# EAGLE design decoder (EAGLE 7.2.0)
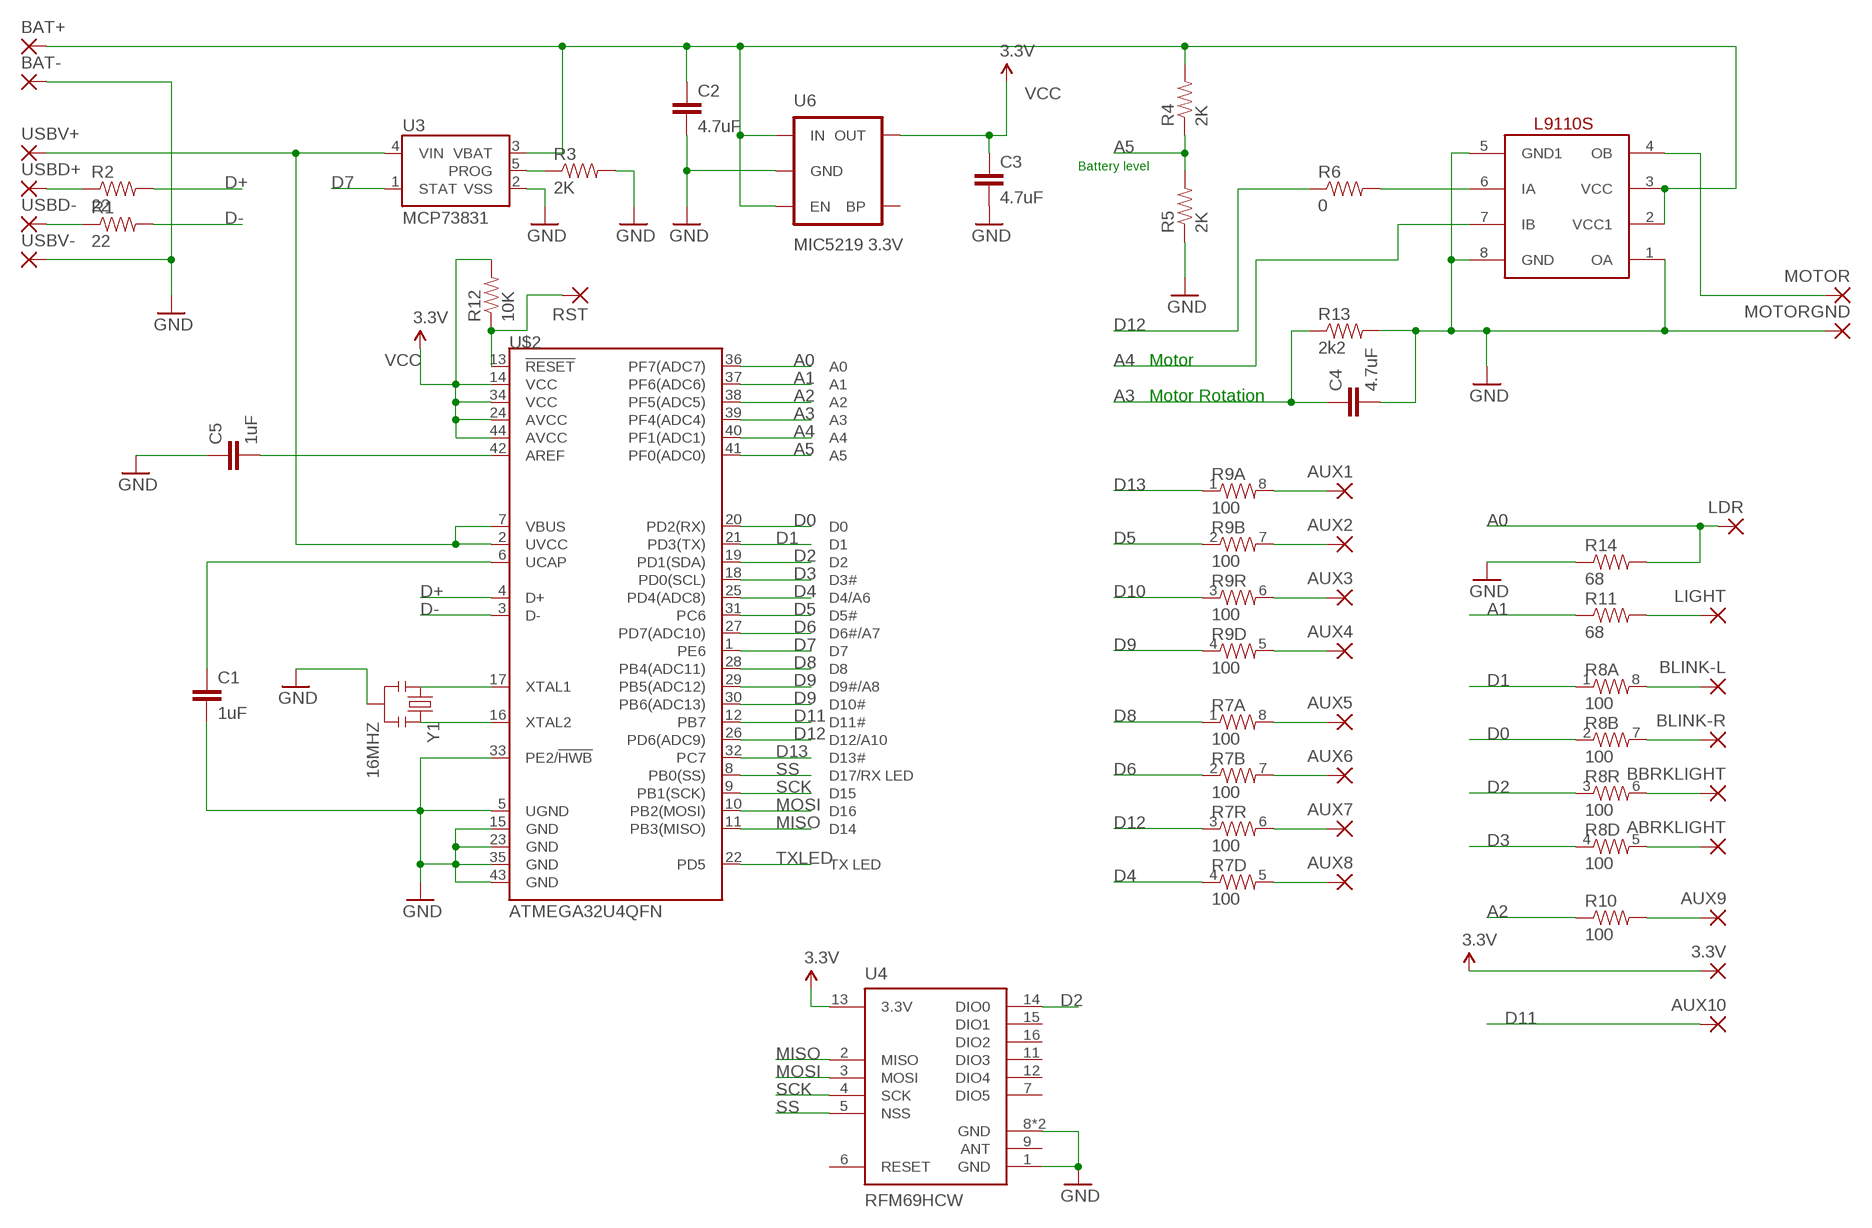
[diagram p0: schematic, sheet 1]

## Parts
3.3V  SMD2  [SMD1,27-2,54]
ABRKLIGHT  SMD2  [SMD1,27-2,54]
AUX1  SMD2  [SMD1,27-2,54]
AUX2  SMD2  [SMD1,27-2,54]
AUX3  SMD2  [SMD1,27-2,54]
AUX4  SMD2  [SMD1,27-2,54]
AUX5  SMD2  [SMD1,27-2,54]
AUX6  SMD2  [SMD1,27-2,54]
AUX7  SMD2  [SMD1,27-2,54]
AUX8  SMD2  [SMD1,27-2,54]
AUX9  SMD2  [SMD1,27-2,54]
AUX10  SMD2  [SMD1,27-2,54]
BAT+  SMD2  [SMD1,27-2,54]
BAT-  SMD2  [SMD1,27-2,54]
BBRKLIGHT  SMD2  [SMD1,27-2,54]
BLINK-L  SMD2  [SMD1,27-2,54]
BLINK-R  SMD2  [SMD1,27-2,54]
C1  1uF  CAP0805  [0805]
C2  4.7uF  CAP0805  [0805]
C3  4.7uF  CAP0805  [0805]
C4  4.7uF  CAP0805  [0805]
C5  1uF  CAP0805  [0805]
LDR  SMD2  [SMD1,27-2,54]
LIGHT  SMD2  [SMD1,27-2,54]
MOTOR  SMD2  [SMD1,27-2,54]
MOTORGND  SMD2  [SMD1,27-2,54]
R1  22  RESISTOR0603-RES  [0603-RES]
R2  22  RESISTOR0603-RES  [0603-RES]
R3  2K  RESISTOR0603-RES  [0603-RES]
R4  2K  RESISTOR0603-RES  [0603-RES]
R5  2K  RESISTOR0603-RES  [0603-RES]
R6  0  RESISTOR0603-RES  [0603-RES]
R7  100  RESISTOR-ARRAY0603-ARV  [0603-ARV]
R8  100  RESISTOR-ARRAY0603-ARV  [0603-ARV]
R9  100  RESISTOR-ARRAY0603-ARV  [0603-ARV]
R10  100  RESISTOR0603-RES  [0603-RES]
R11  68  RESISTOR0603-RES  [0603-RES]
R12  10K  RESISTOR0603-RES  [0603-RES]
R13  2k2  RESISTOR0603-RES  [0603-RES]
R14  68  RESISTOR0603-RES  [0603-RES]
RST  SMD2  [SMD1,27-2,54]
U3  MCP73831  [SOT23-5]
U4  RFM69HCW  [RFM69HCW-XXXS2]
U6  MIC5219 3.3V  V_REG_MIC52193.3V  [SOT23-5]
U$1  L9110S  [SO08]
U$2  ATMEGA32U4QFN  [SPARKFUN-DIGITALIC_QFN-44]
USBD+  SMD2  [SMD1,27-2,54]
USBD-  SMD2  [SMD1,27-2,54]
USBV+  SMD2  [SMD1,27-2,54]
USBV-  SMD2  [SMD1,27-2,54]
Y1  16MHZ  RESONATOR16MHZ  [RESONATOR-SMD]

## Nets
A0: LDR.1(P) R14.2 U$2.36(PF7(ADC7))
A1: R11.1 U$2.37(PF6(ADC6))
A2: R10.1 U$2.38(PF5(ADC5))
A3: C4.1 R13.1 U$2.39(PF4(ADC4))
A4: U$1.7(IB) U$2.40(PF1(ADC1))
A5: R4.1 R5.2 U$2.41(PF0(ADC0))
D0: R8.2 U$2.20(PD2(RX))
D1: R8.1 U$2.21(PD3(TX))
D2: R8.3 U4.14(DIO0) U$2.19(PD1(SDA))
D3: R8.4 U$2.18(PD0(SCL))
D4: R7.4 U$2.25(PD4(ADC8))
D5: R9.2 U$2.31(PC6)
D6: R7.2 U$2.27(PD7(ADC10))
D7: U3.1(STAT) U$2.1(PE6)
D8: R7.1 U$2.28(PB4(ADC11))
D9: R9.4 U$2.29(PB5(ADC12))
D10: R9.3 U$2.30(PB6(ADC13))
D11: AUX10.1(P) U$2.12(PB7)
D12: R6.1 R7.3 U$2.26(PD6(ADC9))
D13: R9.1 U$2.32(PC7)
D+: R2.2 U$2.4(D+)
D-: R1.2 U$2.3(D-)
GND: BAT-.1(P) C1.2 C2.2 C3.2 C4.2 C5.1 MOTORGND.1(P) R3.2 R5.1 R13.2 R14.1 U3.2(VSS) U4.1(GND) U4.8(GND) U4.10(GND) U6.2(GND) U$1.1(OA) U$1.5(GND1) U$1.8(GND) U$2.5(UGND) U$2.15(GND) U$2.23(GND) U$2.33(PE2/!HWB) U$2.35(GND) U$2.43(GND) USBV-.1(P) Y1.2
MISO: U4.2(MISO) U$2.11(PB3(MISO))
MOSI: U4.3(MOSI) U$2.10(PB2(MOSI))
N$1: C1.1 U$2.6(UCAP)
N$2: C5.2 U$2.42(AREF)
N$3: U$2.17(XTAL1) Y1.1
N$4: U$2.16(XTAL2) Y1.3
N$5: R12.1 RST.1(P) U$2.13(!RESET)
N$7: R2.1 USBD+.1(P)
N$8: R1.1 USBD-.1(P)
N$9: U3.4(VIN) U$2.2(UVCC) U$2.7(VBUS) USBV+.1(P)
N$10: BAT+.1(P) C2.1 R4.2 U3.3(VBAT) U6.1(IN) U6.3(EN) U$1.2(VCC1) U$1.3(VCC)
N$11: R3.1 U3.5(PROG)
N$12: LIGHT.1(P) R11.2
N$13: BLINK-L.1(P) R8.8
N$14: R6.2 U$1.6(IA)
N$16: BLINK-R.1(P) R8.7
N$18: BBRKLIGHT.1(P) R8.6
N$20: ABRKLIGHT.1(P) R8.5
N$21: AUX1.1(P) R9.8
N$22: AUX2.1(P) R9.7
N$23: AUX3.1(P) R9.6
N$24: AUX4.1(P) R9.5
N$25: AUX5.1(P) R7.8
N$26: AUX6.1(P) R7.7
N$27: AUX7.1(P) R7.6
N$28: AUX8.1(P) R7.5
N$29: AUX9.1(P) R10.2
OB: MOTOR.1(P) U$1.4(OB)
SCK: U4.4(SCK) U$2.9(PB1(SCK))
SS: U4.5(NSS) U$2.8(PB0(SS))
TXLED: U$2.22(PD5)
VCC: 3.3V.1(P) C3.1 R12.2 U4.13(3.3V) U6.5(OUT) U$2.14(VCC) U$2.24(AVCC) U$2.34(VCC) U$2.44(AVCC) ; supply symbol labelled 3.3V
Unconnected: U4.6(RESET) U4.7(DIO5) U4.9(ANT) U4.11(DIO3) U4.12(DIO4) U4.15(DIO1) U4.16(DIO2) U6.4(BP)

## Notes on the sheet
- Battery level
- Motor
- Motor Rotation

## Library data of the parts
3.3V ABRKLIGHT AUX1-AUX10 BAT+ BAT- BBRKLIGHT BLINK-L BLINK-R LDR LIGHT MOTOR MOTORGND RST USBD+ USBD- USBV+ USBV- = wirepad:SMD2: SMD PAD
C1-C5 = SparkFun-Capacitors:CAP: Capacitor Standard 0603 ceramic capacitor, and 0.1" leaded capacitor.
R1-R6 R10-R14 = SparkFun-Resistors:RESISTOR: Resistor Basic schematic elements and footprints for 0603, 1206, and PTH resistors.
R7-R9 = SparkFun-Resistors:RESISTOR-ARRAY: Array Chip Resistor Source: RS Component / Phycomp
U3 = SparkFun-PowerIC:MCP73831: Miniature single cell, fully integrated Li-Ion, Li-polymer charge management controller http://ww1.microchip.com/downloads/en/DeviceDoc/21984a.pdf IC-09995; PROD_ID: IC-09995
U4 = SparkFun-RF:RFM69H
U6 = SparkFun-PowerIC:V_REG_MIC5219: V_REG MIC5219 Standard 3.3V and 5V 500mA LDO voltage regulator in SOT-23 layout. Micrel part MIC5219. BP (by-pass) pin is used to lower output noise with 470pF cap, may be left open.; PROD_ID: VREG-09872
U$1 = h-bridge-l9119s:L9110S: H Bridge L9110s
U$2 = SparkFun-Retired:ATMEGA32U4: Atmel 44-pin 8-bit Microcontroller with 32KBytes of ISP Flash and USB Controller ----- Please use the QFN-44-NOPAD_1:1 package for the footprint of all boards using a 32U4. Route traces directly away from the pads as much as possible.
Y1 = SparkFun-FreqCtrl:RESONATOR: Resonator Small SMD resonator. Used, eg, on the Arduino Pro/ Pro Mini boards. 8MHz- XTAL-08895 16MHz- XTAL-08900; PROD_ID: XTAL-08900

## Board
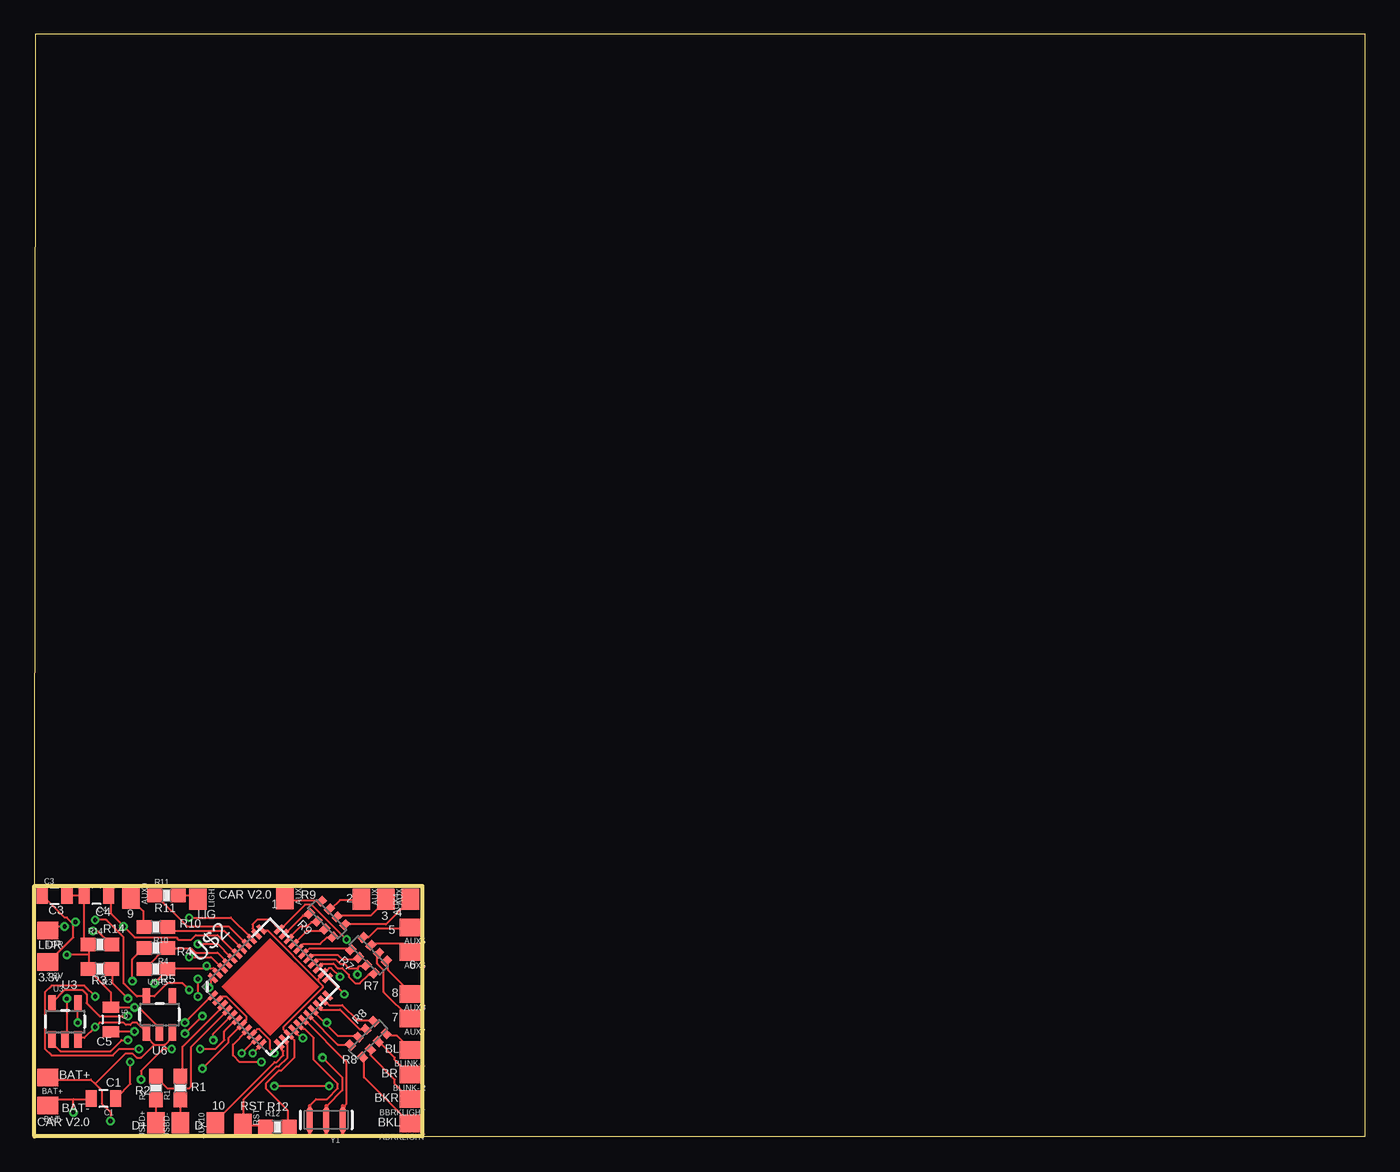
[diagram p1: board, top side]
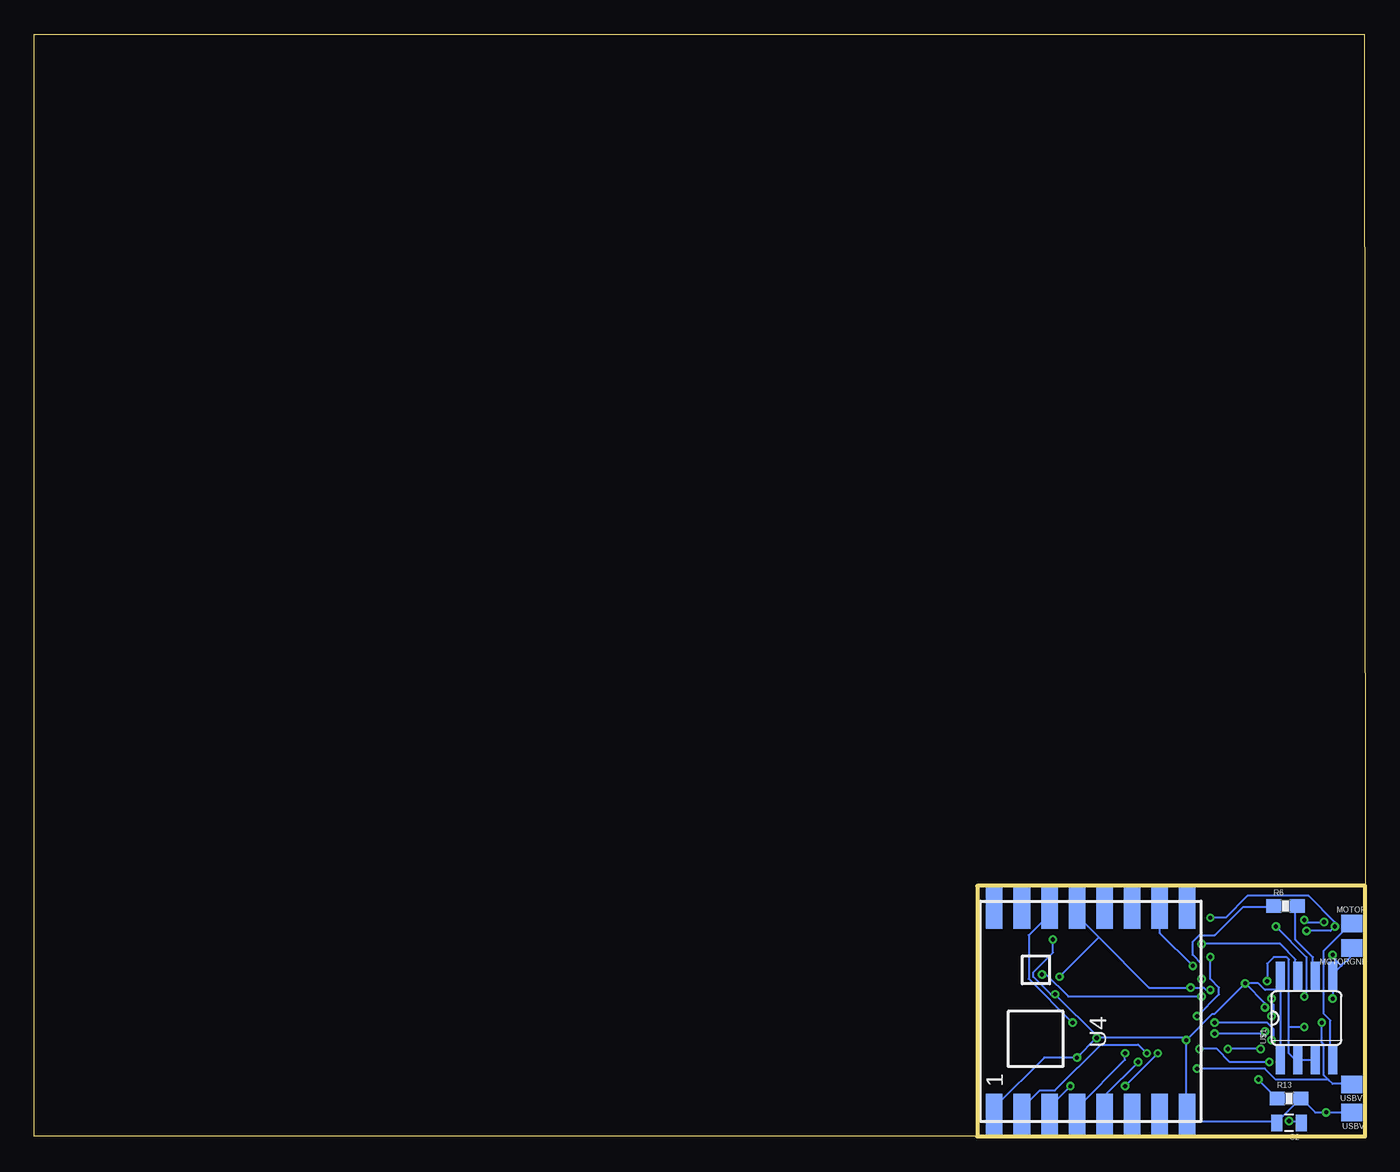
[diagram p2: board, bottom side, seen from below]

Size 96.64 x 80 mm. Coordinates in mm from the lower left corner, seen from the top.
Outline: 28.16,0 96.64,0 96.64,80 0.07,80 0,18.18
Outline: 0,18.18 28.16,18.18 28.16,0
Outline: 28.16,0 0,0 0,18.18
Copper layers (1*16): Top 0.035mm / dielectric 1.5mm / Bottom 0.035mm
Design rules "Elecrow_2-layer_eagle_rule": minimum track width 6mil, minimum drill 12mil, track to track 6mil, track to pad 6mil, pad to pad 6mil, via to via 6mil, smd to smd 0mil, copper to edge 10mil, drill to drill 10mil, minimum pad ring 10mil, minimum via ring 6mil, stop-mask expansion 2mil, vias tented up to drill 100mil, thermal gap 10mil

### Footprints (pad centres in the part's own frame; a part is rotated, then mirrored left to right if it is on the bottom)
SMD1,27-2,54 = smd 1.27 x 1.524: 1 0,0
0805 = smd 0.8 x 1.2: 1 -0.9,0; 2 0.9,0
0603-RES = smd 1.1 x 1: 1 -0.85,0; 2 0.85,0
0603-ARV = smd 0.5 x 0.65: 1 -1.2,-0.625; 2 -0.4,-0.625; 3 0.4,-0.625; 4 1.2,-0.625; 5 1.2,0.625; 6 0.4,0.625; 7 -0.4,0.625; 8 -1.2,0.625
SOT23-5 = smd 0.55 x 1.2: 1 -0.95,-1.3; 2 0,-1.3; 3 0.95,-1.3; 4 0.95,1.3; 5 -0.95,1.3
RFM69HCW-XXXS2 = smd 3 x 1.2: 1 -7.5,7; 2 -7.5,5; 3 -7.5,3; 4 -7.5,1; 5 -7.5,-1; 6 -7.5,-3; 7 -7.5,-5; 8 -7.5,-7; 9 7.5,-7; 10 7.5,-5; 11 7.5,-3; 12 7.5,-1; 13 7.5,1; 14 7.5,3; 15 7.5,5; 16 7.5,7
SO08 = smd 0.66 x 2.032: 1 -1.905,-3.073; 2 -0.635,-3.073; 3 0.635,-3.073; 4 1.905,-3.073; 5 1.905,3.073; 6 0.635,3.073; 7 -0.635,3.073; 8 -1.905,3.073
SPARKFUN-DIGITALIC_QFN-44 = smd 0.8 x 0.3: 1 -3.4,2.5; 2 -3.4,2; 3 -3.4,1.5; 4 -3.4,1; 5 -3.4,0.5; 6 -3.4,0; 7 -3.4,-0.5; 8 -3.4,-1; 9 -3.4,-1.5; 10 -3.4,-2; 11 -3.4,-2.5; 23 3.4,-2.5; 24 3.4,-2; 25 3.4,-1.5; 26 3.4,-1; 27 3.4,-0.5; 28 3.4,0; 29 3.4,0.5; 30 3.4,1; 31 3.4,1.5; 32 3.4,2; 33 3.4,2.5 | smd 0.3 x 0.8: 12 -2.5,-3.4; 13 -2,-3.4; 14 -1.5,-3.4; 15 -1,-3.4; 16 -0.5,-3.4; 17 0,-3.4; 18 0.5,-3.4; 19 1,-3.4; 20 1.5,-3.4; 21 2,-3.4; 22 2.5,-3.4; 34 2.5,3.4; 35 2,3.4; 36 1.5,3.4; 37 1,3.4; 38 0.5,3.4; 39 0,3.4; 40 -0.5,3.4; 41 -1,3.4; 42 -1.5,3.4; 43 -2,3.4; 44 -2.5,3.4
RESONATOR-SMD = smd 0.45 x 1.905: 1 -1.2,0; 2 0,0; 3 1.2,0

### Placement (x,y rotation side)
3.3V  0.96,12.66 90 top
ABRKLIGHT  27.29,0.95 90 top
AUX1  18.19,17.24 180 top
AUX2  23.73,17.21 180 top
AUX3  25.51,17.21 180 top
AUX4  27.29,17.21 0 top
AUX5  27.29,15.18 90 top
AUX6  27.29,13.4 90 top
AUX7  27.29,8.57 90 top
AUX8  27.29,10.35 90 top
AUX9  7.02,17.27 180 top
AUX10  13.15,0.97 0 top
BAT+  0.96,4.28 90 top
BAT-  0.96,2.24 90 top
BBRKLIGHT  27.29,2.73 90 top
BLINK-L  27.29,6.29 90 top
BLINK-R  27.29,4.51 90 top
C1  5.02,2.75 180 top
C2  5.53,0.97 180 bottom
C3  1.46,17.48 0 top
C4  4.51,17.48 180 top
C5  5.55,8.49 270 top
LDR  0.96,14.94 90 top
LIGHT  11.88,17.23 180 top
MOTOR  0.96,15.45 270 bottom
MOTORGND  0.96,13.67 90 bottom
R1  10.61,3.51 90 top
R2  8.83,3.51 90 top
R3  4.77,12.15 180 top
R4  8.83,13.67 180 top
R5  8.83,12.15 180 top
R6  5.78,16.72 0 bottom
R7  24.27,13.14 315 top
R8  24.24,7.05 225 top
R9  21.26,15.78 315 top
R10  8.83,15.2 180 top
R11  9.59,17.48 0 top
R12  17.64,0.7 0 top
R13  5.53,2.75 0 bottom
R14  4.77,13.93 0 top
RST  15.12,0.9 180 top
U3  2.23,8.34 0 top
U4  19.92,9.08 90 bottom
U6  9.08,8.85 0 top
U$1  4.26,8.59 0 bottom
U$2  17.13,10.86 45 top
USBD+  8.83,0.97 0 top
USBD-  10.61,0.97 0 top
USBV+  0.96,3.77 90 bottom
USBV-  0.96,1.74 90 bottom
Y1  21.19,1.21 180 top

### Tracks (layer width: path | path; a pad name or v marks a point on that pad's centre or on a via)
A0  (via drill 0.3)
  Top 0.152: v11.24,15.88 14.26,15.88 15.69,14.45 U$2.36 | v2.19,15.24 1.24,15.24 1.08,15.08 LDR.1 | v4.26,14.92 4.58,14.92 5.53,13.97 R14.2
  Bottom 0.152: v11.24,15.88 10.13,15.88 8.54,17.46 4.1,17.46 2.19,15.56 v2.19,15.24 2.51,14.92 v4.26,14.92
A1
  Top 0.152: U$2.37 15.37,13.97 14.1,15.24 11.08,15.24 8.86,17.46 R11.1
A2
  Top 0.152: U$2.38 15.05,13.65 13.78,14.92 9.97,14.92 9.81,15.08 R10.1
A3  (via drill 0.3)
  Top 0.152: U$2.39 14.58,13.34 13.31,14.61 11.72,14.61 11.4,14.29 10.45,14.29 10.29,14.45 7.27,14.45 v6.48,15.24 5.53,16.19 5.53,17.46 C4.1 | v7.75,4.13 7.75,4.76 9.34,6.35 v9.97,6.35 | v7.59,6.35 6.16,6.35 5.69,5.87 1.24,5.87 0.77,6.35 0.77,10.48 1.24,10.95 3.62,10.95 v4.42,10.16
  Bottom 0.152: v7.75,4.13 6.48,2.86 R13.1 | v7.59,6.35 v9.97,6.35 | v4.42,10.16 4.42,10.32 4.26,10.48 4.26,13.02 v6.48,15.24
A4  (via drill 0.3)
  Top 0.152: v11.88,13.97 13.31,13.97 14.26,13.02 U$2.40
  Bottom 0.152: v11.88,13.97 6.16,13.97 5.05,12.86 5.05,11.75 U$1.7
A5
  Top 0.152: U$2.41 13.94,12.7 13.31,13.34 11.72,13.34 11.4,13.65 9.81,13.65 R4.1 9.66,13.81 8.07,12.22 R5.2
D0
  Top 0.152: R8.2 23.94,7.78 23.63,7.78 22.2,9.21 20.77,9.21 20.61,9.37 U$2.20
D1
  Top 0.152: R8.1 24.58,8.41 23.47,8.41 22.36,9.53 21.4,9.53 21.09,9.84 U$2.21
D2  (via drill 0.3)
  Top 0.152: 21.09,8.26 20.29,9.05 U$2.19 | 21.09,8.26 22.04,7.3 23.47,7.3 R8.3 | v21.24,8.26 21.09,8.26
  Bottom 0.152: v21.24,8.26 24.42,11.43 24.42,14.61 22.99,16.03 22.99,16.51 U4.14
D3
  Top 0.152: R8.4 22.83,6.67 22.04,6.67 19.97,8.73 U$2.18
D4
  Top 0.152: R7.4 24.58,11.75 24.26,11.75 23.63,11.11 23.31,11.11 22.83,11.59 22.83,11.75 22.36,12.22 22.04,12.22 21.72,12.54 20.93,12.54 20.61,12.22 U$2.25
D5
  Top 0.152: R9.2 20.45,15.56 20.13,15.56 19.81,15.24 19.34,15.24 18.54,14.45 U$2.31
D6
  Top 0.152: R7.2 23.47,12.86 22.36,12.86 22.04,13.18 20.13,13.18 19.97,13.02 U$2.27
D7  (via drill 0.3)
  Top 0.152: v10.92,8.26 12.83,10.16 U$2.1 | v6.8,6.99 6.32,6.99 5.53,6.19 1.88,6.19 1.4,6.67 1.4,6.99 U3.1
  Bottom 0.152: v10.92,8.26 7.11,8.26 6.64,7.78 6.64,7.14 v6.8,6.99
D8
  Top 0.152: R7.1 22.83,13.65 19.97,13.65 19.66,13.34 U$2.28
D9
  Top 0.152: R9.4 21.56,14.45 21.24,14.45 20.77,13.97 19.5,13.97 19.18,13.65 U$2.29
D10
  Top 0.152: R9.3 21.09,14.92 19.81,14.92 18.86,13.97 U$2.30
D11
  Top 0.152: U$2.12 17.91,6.67 17.91,6.35 18.07,6.19 18.07,5.87 17.59,5.4 17.43,5.4 13.15,1.11 AUX10.1
D12  (via drill 0.3)
  Top 0.152: 23.47,12.22 23.63,12.38 24.1,12.38 R7.3 | 23.47,12.22 22.83,12.22 22.51,12.54 22.2,12.54 21.88,12.86 20.45,12.86 20.29,12.7 U$2.26 | v11.88,10.16 v11.88,11.43 | 23.47,12.22 v23.47,11.75
  Bottom 0.152: v11.88,11.43 11.88,12.54 12.51,13.18 12.51,14.13 12.04,14.61 10.92,14.61 8.86,16.67 6.64,16.67 R6.1 | v11.88,10.16 21.56,10.16 23.15,11.75 v23.47,11.75
D13
  Top 0.152: R9.1 19.81,16.03 19.5,16.03 18.23,14.76 U$2.32
D+
  Top 0.152: U$2.4 13.94,9.05 11.4,6.51 11.4,3.65 11.24,3.49 9.66,3.49 8.86,4.29 R2.2
D-
  Top 0.152: U$2.3 13.62,9.37 10.77,6.51 10.77,4.45 R1.2
GND  (via drill 0.3)
  Top 0.152: v2.35,10 2.35,7.14 U3.2 | C3.2 2.51,17.46 3.46,17.46 C4.2 3.62,17.46 3.62,14.13 3.78,13.97 R14.1 3.94,13.81 3.94,13.18 | 3.94,13.18 3.94,12.22 R3.2 3.94,12.06 5.53,10.48 5.53,9.53 C5.1 5.69,9.37 v7.27,9.37 7.59,9.37 9.02,7.94 9.02,7.62 U6.2 | 3.94,13.18 v2.35,13.18 | 12.51,12.22 9.81,12.22 R5.1 9.66,12.06 v8.7,11.11 | 12.51,12.22 12.99,12.22 13.31,11.91 U$2.43 | 12.51,12.22 v12.51,12.38 | 2.83,2.7 1.4,2.7 1.08,2.38 BAT-.1 | 2.83,2.7 4.1,2.7 C1.2 | v2.83,1.75 2.83,2.7 | U$2.35 16,14.76 16,14.92 15.85,15.08 15.85,15.4 16.16,15.72 17.12,15.72 17.75,15.08 U$2.33 17.91,15.08 19.66,16.83 20.13,16.83 v22.67,14.29 | v12.99,6.99 12.99,7.46 14.26,8.73 U$2.5 | v19.5,7.14 19.34,7.14 18.86,7.62 U$2.15 | v22.51,10.32 21.4,11.43 U$2.23 | v20.93,5.71 22.36,4.29 22.36,3.33 21.24,2.22 Y1.2
  Bottom 0.152: v2.35,10 2.35,11.59 U$1.5 2.35,11.75 1.72,12.38 | 1.72,12.38 1.08,13.02 1.08,13.65 MOTORGND.1 | 1.72,12.38 2.35,13.02 v2.35,13.18 | 6.16,10.64 6.16,11.59 U$1.8 | 6.16,10.64 6.16,5.56 U$1.1 | v8.7,11.11 7.75,11.11 7.27,10.64 6.16,10.64 | v12.51,12.38 14.89,14.76 14.89,16.51 U4.10 | v7.27,9.37 7.27,9.68 v8.7,11.11 | USBV-.1 1.08,1.75 v2.83,1.75 3.62,1.75 4.58,2.7 R13.2 4.73,2.7 6.32,1.11 C2.2 6.48,1.11 12.51,1.11 12.83,1.43 U4.8 12.99,1.59 v12.99,6.99 | 19.34,7.14 13.15,7.14 v12.99,6.99 | 19.34,7.14 v22.51,10.32 22.83,10.32 24.1,11.59 24.1,11.91 22.67,13.34 v22.67,14.29 | 19.34,7.14 v19.5,7.14 v20.93,5.71 23.31,5.71 26.8,2.22 26.8,1.59 U4.1 | v8.7,11.11 10.92,8.89 11.08,8.89 v12.99,6.99
MISO  (via drill 0.3)
  Top 0.152: v15.85,6.03 16.48,6.67 U$2.11
  Bottom 0.152: v15.85,6.03 16.48,6.67 19.18,6.67 22.51,3.33 23.63,3.33 24.9,2.06 24.9,1.59 U4.2
MOSI  (via drill 0.3)
  Top 0.152: v15.05,6.03 16,6.99 U$2.10 | v21.4,3.65 v17.43,3.65
  Bottom 0.152: v17.43,3.65 v15.05,6.03 | v21.4,3.65 22.83,2.22 22.83,1.59 U4.3
N$1  (via drill 0.3)
  Top 0.152: v12.04,6.35 13.15,6.35 13.78,6.99 13.78,7.62 14.58,8.41 U$2.6 | v6.96,5.4 6.96,3.81 6,2.86 C1.1
  Bottom 0.152: v12.04,6.35 10.77,6.35 9.81,5.4 v6.96,5.4
N$2  (via drill 0.3)
  Top 0.152: v11.24,13.02 12.83,13.02 13.62,12.22 U$2.42 | v10.92,7.46 v12.19,8.73 | v7.27,7.62 5.69,7.62 C5.2
  Bottom 0.152: v11.24,13.02 11.24,11.43 10.61,10.79 10.61,10.32 v12.19,8.73 | v10.92,7.46 7.43,7.46 v7.27,7.62
N$3
  Top 0.152: U$2.17 19.66,8.41 22.67,5.4 22.67,2.38 22.51,2.22 Y1.1
N$4
  Top 0.152: U$2.16 19.5,7.78 19.66,7.78 20.29,7.14 20.29,5.56 22.04,3.81 22.04,3.49 21.24,2.7 20.45,2.7 19.97,2.22 Y1.3
N$5
  Top 0.152: U$2.13 18.23,6.99 18.39,6.83 18.39,5.71 17.75,5.08 17.59,5.08 15.21,2.7 15.21,0.95 RST.1 15.21,0.79 16.64,0.79 R12.1
N$7
  Top 0.152: R2.1 8.86,2.54 8.86,1.11 USBD+.1
N$8
  Top 0.152: R1.1 10.61,2.54 10.61,1.11 USBD-.1
N$9  (via drill 0.3)
  Top 0.152: U$2.2 13.47,10 13.62,10.16 13.94,10.16 15.37,8.73 15.37,8.41 15.21,8.26 U$2.7 15.05,8.1 14.1,7.14 14.1,6.83 v12.19,4.92 | v3.15,8.26 3.15,9.53 U3.4
  Bottom 0.152: v3.15,8.26 3.15,6.83 2.99,6.67 2.99,4.45 2.67,4.13 | 2.67,4.13 2.35,3.81 1.08,3.81 USBV+.1 | v12.19,4.92 7.27,4.92 6.48,4.13 2.67,4.13
N$10  (via drill 0.3)
  Top 0.152: v7.11,11.27 7.11,12.86 7.91,13.65 R4.2 | U3.3 3.31,7.14 3.62,7.14 v4.42,7.94 4.73,8.26 6.48,8.26 6.64,8.1 6.96,8.1 7.11,8.26 7.43,8.26 8.07,7.62 U6.1 8.23,7.46 8.23,7.14 8.7,6.67 | 8.7,6.67 9.5,6.67 9.97,7.14 9.97,7.46 U6.3 | v5.53,1.11 5.53,1.75 4.89,2.38 4.89,3.33 4.42,3.81 | 4.42,3.81 4.1,4.13 1.08,4.13 BAT+.1 | 8.7,6.67 7.75,5.71 7.43,5.71 7.11,6.03 6.64,6.03 4.42,3.81
  Bottom 0.152: v7.11,11.27 7.11,12.54 6.64,13.02 5.69,13.02 5.53,12.86 5.53,7.94 | 5.53,7.94 5.53,6.03 5.05,5.56 U$1.2 4.89,5.56 3.78,5.56 U$1.3 | v5.53,1.11 4.73,1.11 C2.1 | v4.42,7.94 5.53,7.94
N$11  (via drill 0.3)
  Top 0.152: v6.8,10 5.69,11.11 5.69,12.06 R3.1 | v6.8,8.73 4.73,8.73 3.78,9.68 3.78,10.32 3.46,10.64 2.19,10.64 1.24,9.68 U3.5
  Bottom 0.152: v6.8,10 6.8,9.68 6.64,9.53 6.64,8.89 v6.8,8.73
N$12
  Top 0.152: R11.2 10.45,17.46 11.72,17.46 11.88,17.3 LIGHT.1
N$13
  Top 0.152: R8.8 25.69,7.3 26.32,7.3 27.28,6.35 BLINK-L.1
N$14
  Bottom 0.152: R6.2 5.05,16.67 5.05,14.29 3.78,13.02 3.78,11.75 U$1.6
N$16
  Top 0.152: R8.7 25.05,6.83 26.16,5.71 26.16,5.56 27.28,4.45 BLINK-R.1
N$18
  Top 0.152: R8.6 24.42,6.19 24.42,5.87 26.16,4.13 26.16,3.81 27.28,2.7 BBRKLIGHT.1
N$20
  Top 0.152: R8.5 23.94,5.71 23.94,4.29 27.28,0.95 ABRKLIGHT.1
N$21
  Top 0.152: R9.8 20.77,17.14 18.23,17.14 AUX1.1
N$22
  Top 0.152: R9.7 21.56,16.51 22.2,17.14 23.63,17.14 AUX2.1
N$23
  Top 0.152: R9.6 22.04,16.03 24.42,16.03 25.53,17.14 AUX3.1
N$24
  Top 0.152: R9.5 22.67,15.4 25.53,15.4 27.28,17.14 AUX4.1
N$25
  Top 0.152: R7.8 23.94,14.45 24.26,14.45 24.9,15.08 27.28,15.08 AUX5.1
N$26
  Top 0.152: R7.7 24.58,13.97 26.8,13.97 27.28,13.49 AUX6.1
N$27
  Top 0.152: R7.6 24.9,13.18 24.9,12.54 25.37,12.06 25.37,10.48 27.28,8.57 AUX7.1
N$28
  Top 0.152: R7.5 25.69,12.7 25.69,12.06 27.28,10.48 AUX8.1
N$29
  Top 0.152: R10.2 7.91,15.24 7.91,16.35 7.11,17.14 AUX9.1
OB
  Bottom 0.152: MOTOR.1 1.08,15.4 2.99,13.49 2.99,8.89 2.51,8.41 2.51,5.56 U$1.4
SCK  (via drill 0.3)
  Top 0.152: v17.43,6.03 17.12,6.35 17.12,6.99 16.32,7.78 16.16,7.78 15.85,7.46 U$2.9
  Bottom 0.152: v17.43,6.03 17.43,5.56 20.77,2.22 20.77,1.59 U4.4
SS  (via drill 0.3)
  Top 0.152: v16.48,5.4 14.89,5.4 14.42,5.87 14.42,6.67 15.37,7.62 U$2.8
  Bottom 0.152: v16.48,5.4 18.86,3.02 18.86,1.59 U4.5
VCC  (via drill 0.3)
  Top 0.152: 20.61,11.27 20.93,10.95 20.93,10.79 18.07,7.94 18.07,7.78 18.39,7.46 U$2.14 18.54,7.3 18.86,6.99 18.86,5.71 17.91,4.76 17.75,4.76 16.8,3.81 16.8,3.49 18.39,1.91 18.39,0.79 R12.2 | 20.61,11.27 20.61,11.43 20.93,11.75 U$2.24 21.09,11.91 21.4,12.22 21.56,12.22 v22.2,11.59 | 20.61,11.27 16.96,14.92 16.64,14.92 U$2.34 | 2.83,15.4 2.35,15.88 2.19,15.88 0.61,17.46 C3.1 | 2.83,15.4 2.83,14.45 1.08,12.7 3.3V.1 | v12.67,10.79 12.83,10.95 12.83,11.43 U$2.44 | v11.24,10.64 10.77,11.11 9.66,11.11 8.7,10.16 8.23,10.16 U6.5 8.07,10.16 7.43,10.16 6.48,11.11 6.48,14.45 5.21,15.72 v4.42,15.72 | v2.99,15.56 2.83,15.4
  Bottom 0.152: 19.34,14.45 20.77,15.88 20.77,16.51 U4.13 | 19.34,14.45 15.69,10.79 v12.67,10.79 11.72,10.79 11.56,10.64 v11.24,10.64 | v2.99,15.56 4.26,15.56 v4.42,15.72 | 19.34,14.45 v22.2,11.59

### Text on the board
_tsilk: CAR V2.0 | 1 | R9 | 2 | C3 | C4 | 9 | R11 | LIG | 3 | 4 | R14 | R10 | 5 | LDR | R4 | 6 | 3.3v | U3 | R3 | R5 | R7 | 8 | 7 | C5 | U6 | BL | R8 | BAT+ | C1 | BR | R2 | R1 | BAT- | 10 | RST | R12 | BKR | CAR V2.0 | BKL | D+ | D-
_bsilk: MT+ | R6 | MT- | H-B | GND | SCK | GND | MOSI | MISO | GND | USBV+ | R13 | USBV- | C2 | CAR V2.0